# Altium schematic sheet ToF_sensors.SchDoc
size A4; SheetNumber: 5; SheetTotal: 6
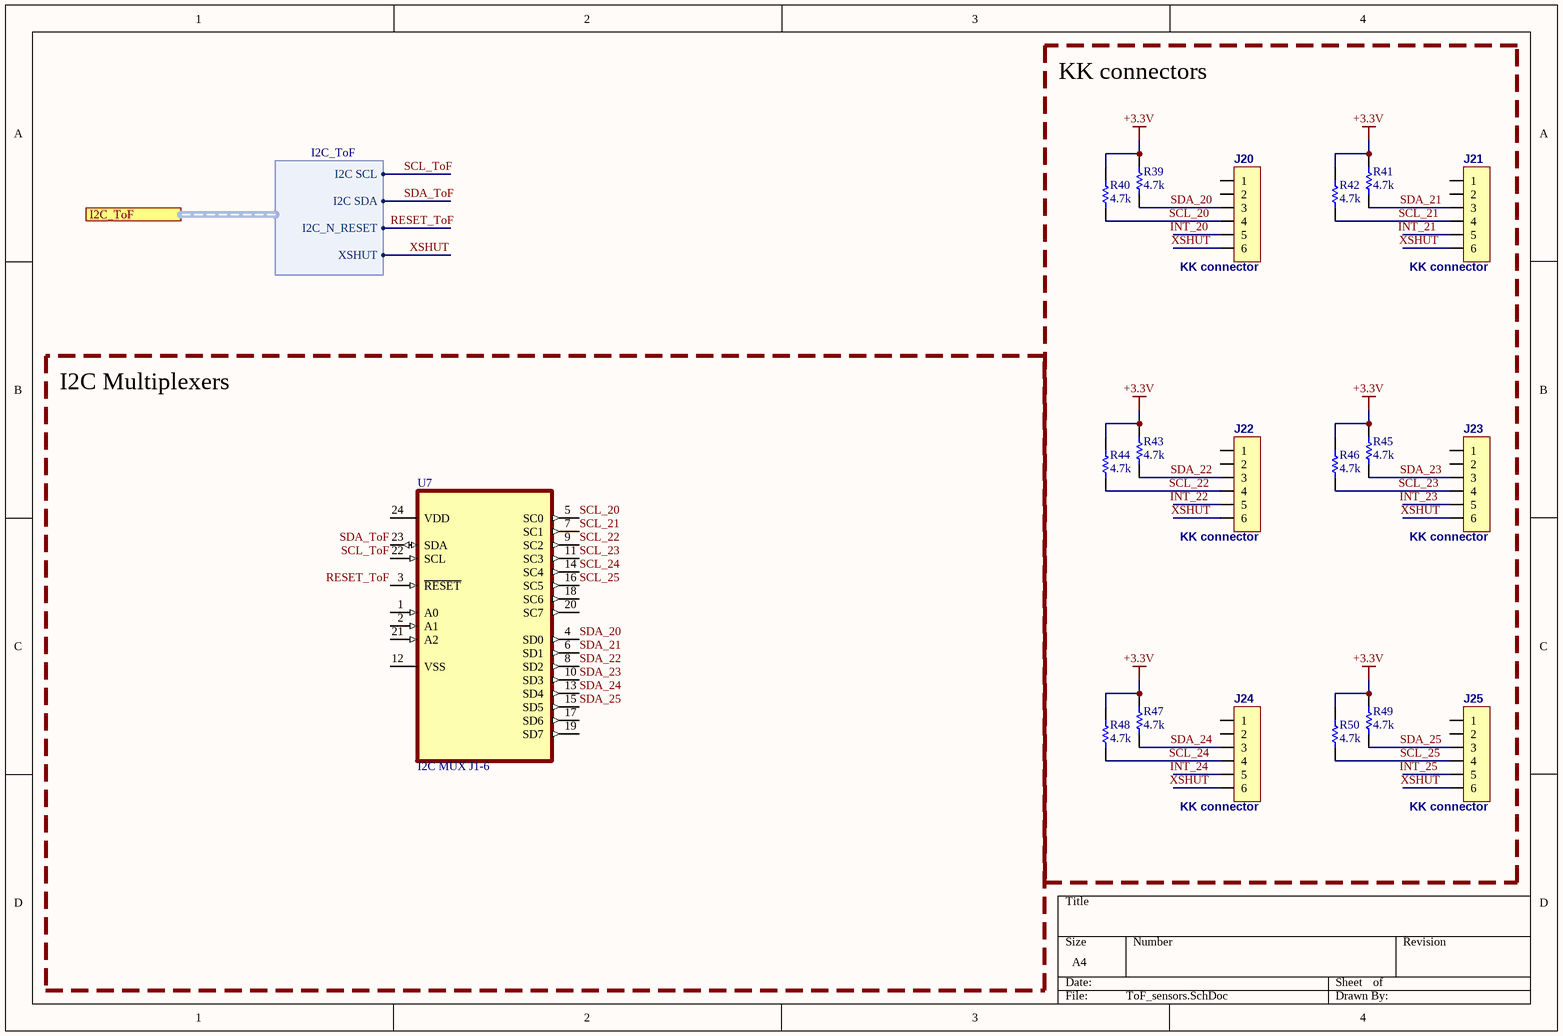
[diagram p0: ToF_sensors.SchDoc]

## Parts
J20  KK connector  [KK/2.54/6]
J21  KK connector  [KK/2.54/6]
J22  KK connector  [KK/2.54/6]
J23  KK connector  [KK/2.54/6]
J24  KK connector  [KK/2.54/6]
J25  KK connector  [KK/2.54/6]
R39  4.7k  [RESC1609X50X30ML10T20]
R40  4.7k  [RESC1609X50X30ML10T20]
R41  4.7k  [RESC1609X50X30ML10T20]
R42  4.7k  [RESC1609X50X30ML10T20]
R43  4.7k  [RESC1609X50X30ML10T20]
R44  4.7k  [RESC1609X50X30ML10T20]
R45  4.7k  [RESC1609X50X30ML10T20]
R46  4.7k  [RESC1609X50X30ML10T20]
R47  4.7k  [RESC1609X50X30ML10T20]
R48  4.7k  [RESC1609X50X30ML10T20]
R49  4.7k  [RESC1609X50X30ML10T20]
R50  4.7k  [RESC1609X50X30ML10T20]
U7  I2C MUX J1-6  [SOP65P640X110-24N]

## Blocks framed on the sheet
KK connectors: J20-J25 R39-R50
I2C Multiplexers: U7

## Ports
I2C_ToF (harness I2C_ToF, see Schield_elkapod[2A], Logic_controller[1B])

## Harnesses
I2C_ToF: I2C SCL, I2C SDA, I2C_N_RESET, XSHUT

## Nets
+3.3V: R39.2 R40.2 R41.2 R42.2 R43.2 R44.2 R45.2 R46.2 R47.2 R48.2 R49.2 R50.2
INT_20: J20.5
INT_21: J21.5
INT_22: J22.5
INT_23: J23.5
INT_24: J24.5
INT_25: J25.5
RESET_ToF: U7.3(~{RESET}) ; port I2C_ToF.I2C_N_RESET
SCL_20: J20.4 R40.1 U7.5(SC0)
SCL_21: J21.4 R42.1 U7.7(SC1)
SCL_22: J22.4 R44.1 U7.9(SC2)
SCL_23: J23.4 R46.1 U7.11(SC3)
SCL_24: J24.4 R48.1 U7.14(SC4)
SCL_25: J25.4 R50.1 U7.16(SC5)
SCL_ToF: U7.22(SCL) ; port I2C_ToF.I2C SCL
SDA_20: J20.3 R39.1 U7.4(SD0)
SDA_21: J21.3 R41.1 U7.6(SD1)
SDA_22: J22.3 R43.1 U7.8(SD2)
SDA_23: J23.3 R45.1 U7.10(SD3)
SDA_24: J24.3 R47.1 U7.13(SD4)
SDA_25: J25.3 R49.1 U7.15(SD5)
SDA_ToF: U7.23(SDA) ; port I2C_ToF.I2C SDA
XSHUT: J20.6 J21.6 J22.6 J23.6 J24.6 J25.6 ; port I2C_ToF.XSHUT

Not connected (* = marked no-connect by the designer): J20 1 2; J21 1 2; J22 1 2; J23 1 2; J24 1 2; J25 1 2; U7 1(A0) 2(A1) 12(VSS) 17(SD6) 18(SC6) 19(SD7) 20(SC7) 21(A2) 24(VDD)

## Library data of the parts
J20-J25 = CN_6x1: Connector: PCB-cable; KK; socket; male; PIN:6; straight/right-angle; tinned; THT, KK/2,54mm
R39-R50 = CMP-2000-03860-1: RES 4,7K OHM 1% 0,1W 0603 RNCS0603BKE10K0; Part Number: CRCW060311K0FKEA; Manufacturer: Vishay Dale
U7 = CMP-020-000000-2: Translating Multiplexer Interface 24-TSSOP PCA9547PW,118; MF: NXP USA; Component Type: Standard; Availability: Unavailable; Pin Count: 24; Package: TSSOP-24 NXP Semiconductors; Source: SnapEDAsch.SchLib; Price: None; SnapEDA_Link: https://www.snapeda.com/parts/PCA9547PW,118/NXP%20USA%20Inc./view-part/571417/?ref=snap; Design Item ID: PCA9547PW,118; MP: PCA9547PW,118; Value: *